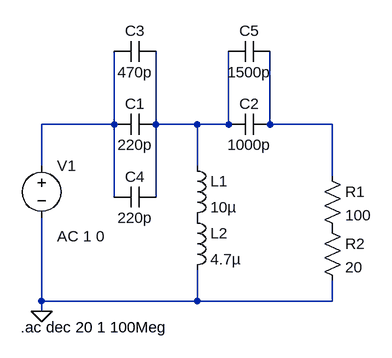
[diagram p0: schematic 4_butter_hpf_miss.asc]
4_butter_hpf_miss.asc, the LTspice schematic file:
Version 4
SHEET 1 972 680
WIRE 368 80 368 -32
WIRE 128 80 128 -32
WIRE 128 80 16 80
WIRE 192 80 192 -32
WIRE 256 80 192 80
WIRE 304 80 304 -32
WIRE 304 80 256 80
WIRE 464 80 368 80
WIRE 16 144 16 80
WIRE 256 144 256 80
WIRE 464 160 464 80
WIRE 128 192 128 80
WIRE 192 192 192 80
WIRE 16 352 16 224
WIRE 256 352 256 304
WIRE 256 352 16 352
WIRE 464 352 464 320
WIRE 464 352 256 352
WIRE 16 368 16 352
FLAG 16 368 0
SYMBOL voltage 16 128 R0
WINDOW 123 24 124 Left 2
WINDOW 39 0 0 Left 2
SYMATTR Value2 AC 1 0
SYMATTR InstName V1
SYMATTR Value ""
SYMBOL res 448 144 R0
SYMATTR InstName R1
SYMATTR Value 100
SYMBOL cap 192 64 R90
WINDOW 0 0 32 VBottom 2
WINDOW 3 32 32 VTop 2
SYMATTR InstName C1
SYMATTR Value 220p
SYMBOL cap 368 64 R90
WINDOW 0 0 32 VBottom 2
WINDOW 3 32 32 VTop 2
SYMATTR InstName C2
SYMATTR Value 1000p
SYMBOL ind 240 128 R0
SYMATTR InstName L1
SYMATTR Value 10µ
SYMBOL cap 192 -48 R90
WINDOW 0 0 32 VBottom 2
WINDOW 3 32 32 VTop 2
SYMATTR InstName C3
SYMATTR Value 470p
SYMBOL cap 192 176 R90
WINDOW 0 0 32 VBottom 2
WINDOW 3 32 32 VTop 2
SYMATTR InstName C4
SYMATTR Value 220p
SYMBOL cap 368 -48 R90
WINDOW 0 0 32 VBottom 2
WINDOW 3 32 32 VTop 2
SYMATTR InstName C5
SYMATTR Value 1500p
SYMBOL ind 240 208 R0
SYMATTR InstName L2
SYMATTR Value 4.7µ
SYMBOL res 448 224 R0
SYMATTR InstName R2
SYMATTR Value 20
TEXT -16 392 Left 2 !.ac dec 20 1 100Meg

The netlist it stands for:
* 4_butter_hpf_miss.asc
V1 N002 0 AC 1 0
R1 N001 P001 100
C1 N003 N002 220p
C2 N001 N003 1000p
L1 N003 P002 10µ
C3 N003 N002 470p
C4 N003 N002 220p
C5 N001 N003 1500p
L2 P002 0 4.7µ
R2 P001 0 20
.ac dec 20 1 100Meg
.backanno
.end